# Altium project Bemine-neo.PrjPcb
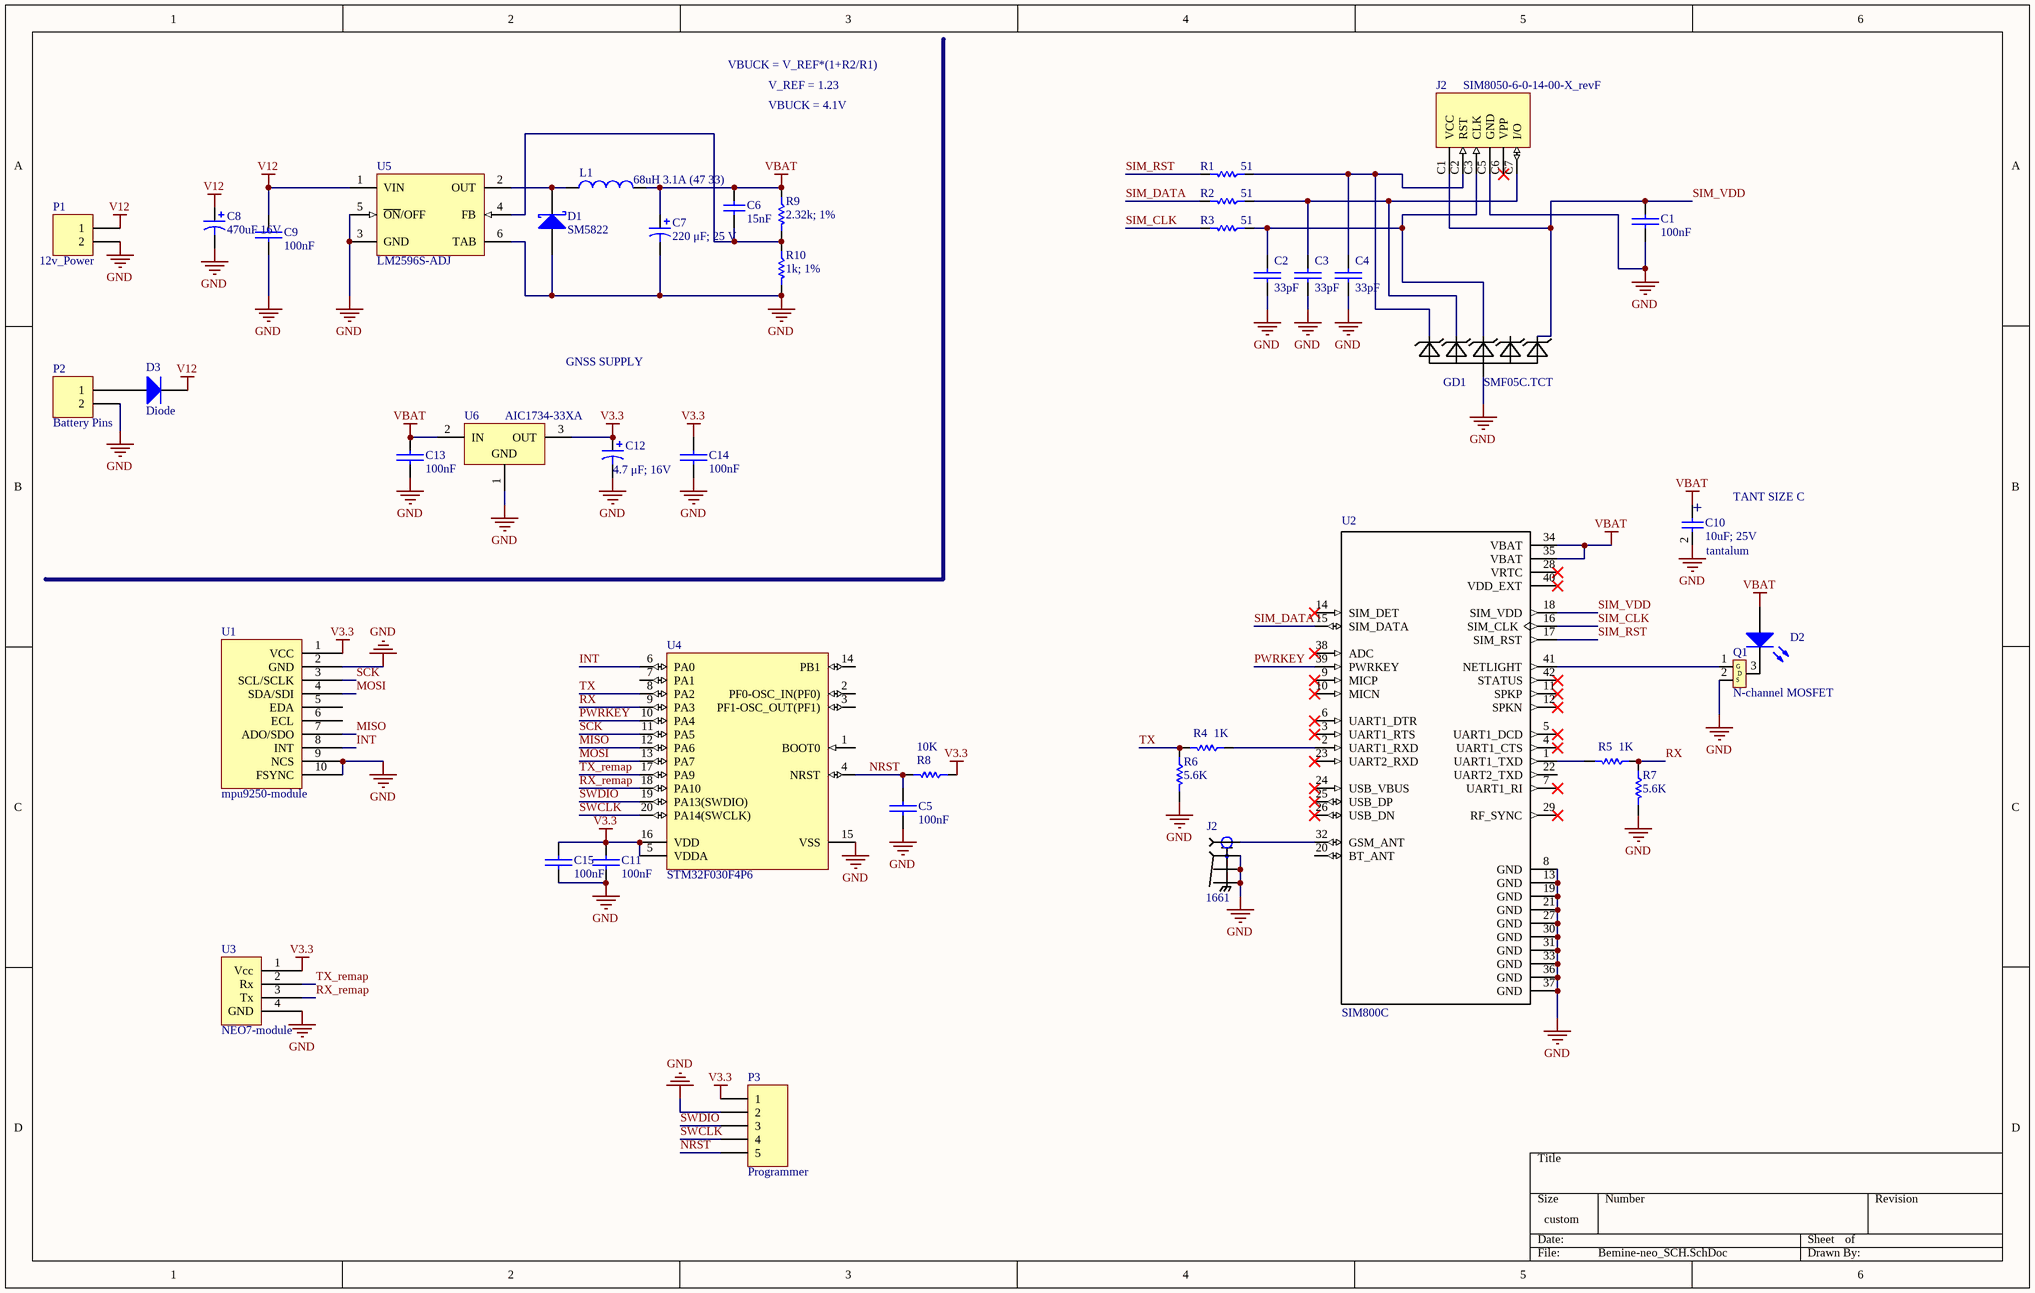
[diagram p0: Bemine-neo_SCH.SchDoc]
1 sheet, 42 parts. Net scope: global (net labels, ports and power ports of the same name join across sheets).

## Sheet Bemine-neo_SCH.SchDoc
size 381 x 241 mm

### Parts
(Parts that share a designator on the sheet are numbered #1, #2 ... from top to bottom, then left to right.)
C1  100nF  [0603R-1k]
C2  33pF  [0603R-1k]
C3  33pF  [0603R-1k]
C4  33pF  [0603R-1k]
C5  100nF  [0603R-1k]
C6  15nF  [0603R-1k]
C7  220 μF; 25 V  [E]
C8  470uF 16V  [F]
C9  100nF  [0603R-1k]
C10  10uF; 25V  TYPE: tantalum  [CAPCP6032X280N]
C11  100nF  [0603R-1k]
C12  4.7 μF; 16V  [CAPR5-4X5]
C13  100nF  [0603R-1k]
C14  100nF  [0603R-1k]
C15  100nF  [0603R-1k]
D1  SM5822  [SMB]
D2  LED2  [C1206]  (value not drawn)
D3  Diode  [SMB]
GD1  SMF05C.TCT  [SC70-6]
J2#1  SIM8050-6-0-14-00-X_revF  [SIM8050-6-0-14-00-X_revF]
J2#2  1661  [MOLEX_1661]
L1  68uH 3.1A (47 33)  [CAPR5-4X5]
P1  12v_Power  [phoenix-2pin-200mil]
P2  Battery Pins  [HDR1X2]
P3  Programmer  [HDR1X5]
Q1  N-channel MOSFET  [SOT23]
R1  51  [0603R-1k]
R2  51  [0603R-1k]
R3  51  [0603R-1k]
R4  1K  [0603R-1k]
R5  1K  [0603R-1k]
R6  5.6K  [0603R-1k]
R7  5.6K  [0603R-1k]
R8  10K  [0603R-1k]
R9  2.32k; 1%  [0603R-1k]
R10  1k; 1%  [0603R-1k]
U1  mpu9250-module  [mpu9250-module]
U2  SIM800C  [LCC110P1570X1760X250-42N]
U3  NEO7-module  [NEO7-module]
U4  STM32F030F4P6  [STM-TSSOP20_N]
U5  LM2596S-ADJ  [TS5B_N]
U6  AIC1734-33XA  [SOT89N]

### Nets
GND: C1.2(-) C2.2(-) C3.2(-) C4.2(-) C5.2(-) C7.2 C8.2 C9.2(-) C10.2 C11.2(-) C12.2 C13.2(-) C14.2(-) C15.2(-) D1.1(A) GD1.2(A) J2#1.C5(GND) J2#2.2(GND) J2#2.3(GND) J2#2.4(GND) P1.2 P2.2 P3.2 Q1.2(S) R6.2 R7.2 R10.2 U1.2(GND) U1.9(NCS) U1.10(FSYNC) U2.8(GND) U2.13(GND) U2.19(GND) U2.21(GND) U2.27(GND) U2.30(GND) U2.31(GND) U2.33(GND) U2.36(GND) U2.37(GND) U3.4(GND) U4.15(VSS) U5.3(GND) U5.5(~{ON}/OFF) U5.6(TAB) U6.1(GND)
V3.3: C11.1(+) C12.1 C14.1(+) C15.1(+) P3.1 R8.1 U1.1(VCC) U3.1(Vcc) U4.5(VDDA) U4.16(VDD) U6.3(OUT)
V12: C8.1 C9.1(+) D3.2(K) P1.1 U5.1(VIN)
VBAT: C6.2 C7.1 C10.1 C13.1(+) D2.1(A) L1.2 R9.1 U2.34(VBAT) U2.35(VBAT) U6.2(IN)
INT: U1.8(INT) U4.6(PA0)
MISO: U1.7(ADO/SDO) U4.12(PA6)
MOSI: U1.4(SDA/SDI) U4.13(PA7)
NRST: C5.1(+) P3.5 R8.2 U4.4(NRST)
PWRKEY: U2.39(PWRKEY) U4.10(PA4)
RX: R5.1 R7.1 U4.9(PA3)
RX_remap: U3.3(Tx) U4.18(PA10)
SCK: U1.3(SCL/SCLK) U4.11(PA5)
SIM_CLK: R3.2 U2.16(SIM_CLK)
SIM_DATA: R2.2 U2.15(SIM_DATA)
SIM_RST: R1.2 U2.17(SIM_RST)
SIM_VDD: C1.1(+) GD1.6(C5) J2#1.C1(VCC) U2.18(SIM_VDD)
SWCLK: P3.4 U4.20(PA14(SWCLK))
SWDIO: P3.3 U4.19(PA13(SWDIO))
TX: R4.2 R6.1 U4.8(PA2)
TX_remap: U3.2(Rx) U4.17(PA9)
NetC2_1: C2.1(+) GD1.4(C3) J2#1.C3(CLK) R3.1
NetC3_1: C3.1(+) GD1.3(C2) J2#1.C7(I/O) R2.1
NetC4_1: C4.1(+) GD1.1(C1) J2#1.C2(RST) R1.1
NetC6_1: C6.1 R9.2 R10.1 U5.4(FB)
NetD1_2: D1.2(K) L1.1 U5.2(OUT)
NetD2_2: D2.2(K) Q1.3(D)
NetD3_1: D3.1(A) P2.1
NetJ2#2_1: J2#2.1(SIG) U2.32(GSM_ANT)
NetQ1_1: Q1.1(G) U2.41(NETLIGHT)
NetR4_1: R4.1 U2.2(UART1_RXD)
NetR5_2: R5.2 U2.1(UART1_TXD)

Not connected (* = marked no-connect by the designer): GD1 5(C4); J2#1 C6(VPP)*; U1 5(EDA) 6(ECL); U2 3(UART1_RTS)* 4(UART1_CTS)* 5(UART1_DCD)* 6(UART1_DTR)* 7(UART1_RI)* 9(MICP)* 10(MICN)* 11(SPKP)* 12(SPKN)* 14(SIM_DET)* 20(BT_ANT) 22(UART2_TXD) 23(UART2_RXD)* 24(USB_VBUS)* 25(USB_DP)* 26(USB_DN)* 28(VRTC)* 29(RF_SYNC)* 38(ADC)* 40(VDD_EXT)* 42(STATUS)*; U4 1(BOOT0) 2(PF0-OSC_IN(PF0)) 3(PF1-OSC_OUT(PF1)) 7(PA1) 14(PB1)

### Notes on the sheet
- VBUCK = V_REF*(1+R2/R1)
- V_REF = 1.23
- VBUCK = 4.1V
- GNSS SUPPLY
- (near C10) TANT SIZE C
- (near C10) +

### Library data of the parts
C1-C5 C9 C11 C13-C15 = Cap-Bipolar: Bipolar Capacitor; Voltage: 100V; Designer: Saeid Jorablo; Organazation: ControTec; Adding Date: 1387/12/20
  C1 C5 C9 C11 C13-C15: Value: 100nF
  C2-C4: Value: 33pF
C6 = Cap: Capacitor; STATE: NOT-AVAILABLE; TYPE: tantalum; Published: 8-Jun-2000; LatestRevisionDate: 17-Jul-2002; LatestRevisionNote: Re-released for DXP Platform.; PackageReference: RAD-0.3; Publisher: Altium Limited; PackageDescription: Radial Cap, Thru-Hole; 2 Leads; 0.3 in Pin Spacing
C7 = 94SH107X0016EBP: Solid Aluminum Capacitor with Organic Semiconductor Electrolyte: 100uF, 16V, Bulk Pack; Note: Part Numbers shown are for ± 20% capacitance tolerance (X0).; PCB_Layout: Complies with Manufacturer's Recommendation.; DrillSize: Nominal, Rounded to the nearest 0.1mm; Published: 19-Mar-2004; DatasheetDocument: 23-May-2001; PackageReference: E; Publisher: Altium Limited; ComponentLink1Description: Manufacturer Link; ComponentLink1URL: http://www.vishay.com/; ComponentLink2Description: Datasheet; ComponentLink2URL: http://www.vishay.com/docs/90006/94sh.pdf; Value: 100uF
C8 = 94SS477X0004FBP: Solid Aluminum Capacitor with Organic Semiconductor Electrolyte: 470uF, 4V, Bulk Pack; Note: Part Numbers shown are for ± 20% capacitance tolerance (X0).; PCB_Layout: Complies with Manufacturer's Recommendation.; DrillSize: Nominal, Rounded to the nearest 0.1mm; Published: 19-Mar-2004; DatasheetDocument: 23-May-2001; PackageReference: F; Publisher: Altium Limited; ComponentLink1Description: Manufacturer Link; ComponentLink1URL: http://www.vishay.com/; ComponentLink2Description: Datasheet; ComponentLink2URL: http://www.vishay.com/docs/90008/94ss.pdf; Value: 470uF
C10 = Cap: Capacitor; STATE: NOT-AVAILABLE; Published: 8-Jun-2000; LatestRevisionDate: 17-Jul-2002; LatestRevisionNote: Re-released for DXP Platform.; PackageReference: RAD-0.3; Publisher: Altium Limited; PackageDescription: Radial Cap, Thru-Hole; 2 Leads; 0.3 in Pin Spacing
C12 = WCAP-PSLP 5x5.8x1.4 875105359003: WCAP-PSLP Aluminum Polymer Capacitors , 22 μF; + / - 20%; 16 V , 5 x 5,8; Manufacturer: Wurth Elektronik; E-mail: libraries@we-online.com; Capacitance: 22 μF; Characteristics: Aluminum Polymer Capacitors;Recommended soldering: Reflow;Operating temperature: –55 °C to +105 °C;Low profile SMD product series;Low ESR at high frequency range;High permissible ripple current;Load life: 2000 h @ +105 °C; ComponentLink1Description: Manufacturer; ComponentLink1URL: http://www.we-online.com; ComponentLink2Description: Datasheet; ComponentLink2URL: http://katalog.we-online.de/pbs/datasheet/875105359003.pdf; Created by: Karrer Zheng; Created Date: 5/13/2015; Application: Low voltage port filtering, appplid to high-end switching power supply, PC(desktop,laptop ),industrial computer, VGA card, server power, charger, TV, digital set-top box,DC-DC power module, game machine etc which consume large current with high speed circuit.; partNo: 875105359003
D1 = D Schottky: Schottky Diode; Published: 8-Jun-2000; LatestRevisionDate: 17-Jul-2002; LatestRevisionNote: Re-released for DXP Platform.; PackageReference: SMB; Publisher: Altium Limited; PackageDescription: DO-214-AA/SMB; 2 C-Bend Leads; Body 5.3 x 3.6 mm, inc. leads (LxW); Code_JEDEC: DO-214-AA
D2 = LED2: Typical RED, GREEN, YELLOW, AMBER GaAs LED; Published: 8-Jun-2000; LatestRevisionDate: 17-Jul-2002; LatestRevisionNote: Re-released for DXP Platform.; PackageVersion: Feb-2002; PackageReference: 3.2X1.6X1.1; Publisher: Altium Limited; PackageDescription: SM LED; 2 Flat Leads
D3 = Diode: Default Diode; Published: 8-Jun-2000; LatestRevisionDate: 17-Jul-2002; LatestRevisionNote: Re-released for DXP Platform.; PackageVersion: Sep-1996; PackageReference: SMC; Publisher: Altium Limited; PackageDescription: DO-214-AB/SMC; 2 C-Bend Leads; Body 7.9 x 5.9 mm, inc. leads (LxW); Code_JEDEC: DO-214-AB
GD1 = SMF05C.TCT: MF: Semtech; Price: None; Package: SOT-363 Diodes Inc.; Availability: Unavailable; MP: SMF05C.TCT; Value: *
J2#1 = SIM8050-6-0-14-00-X_revF: Nano SIM Card Connector, Push-Pull Type, 6 Pin, SMT, Profile 1.35mm
J2#2 = 1661: uFL SMT Antenna Connector; MF: Keystone Electronics; Availability: Unavailable; Package: None; SnapEDA_Link: https://www.snapeda.com/parts/1661/Keystone%20Electronics/view-part/?ref=snap; Price: None; MP: 1661; Value: *
L1 = Inductor: Code_IEC: 1005; Value: 10mH; Published: 8-Jun-2000; LatestRevisionDate: 29-May-2009; LatestRevisionNote: IPC-7351 Footprint Added.; PackageReference: 0402-A; Publisher: Altium Limited; PackageDescription: Chip Inductor; Code_JEITA: 0402
P1 P2 = Header 2: Header, 2-Pin; LatestRevisionDate: 17-Jul-2002; LatestRevisionNote: Re-released for DXP Platform.; Publisher: Altium Limited
P3 = Header 5: Header, 5-Pin; LatestRevisionDate: 17-Jul-2002; LatestRevisionNote: Re-released for DXP Platform.; Publisher: Altium Limited
Q1 = 2N7002: NPN transistor
R1-R10 = Resistor
  R1-R3: Value: 51
  R4 R5: Value: 1K
  R6 R7: Value: 5.6K
  R8: Value: 10K
  R9: Value: 2.32k; 1%
  R10: Value: 1k; 1%
U2 = SIM800C: Module: GSM/Bluetooth; GPRS; 2G; 1800MHz, 900MHz; 85.6kbps; SMD; MF: Simcom; Price: None; Availability: Unavailable; Package: None; SnapEDA_Link: https://www.snapeda.com/parts/SIM800C/Simcom/view-part/?ref=snap; MP: SIM800C; Value: *
U4 = STM32F030F4P6: ARM Cortex-M0 32-bit MCU, 16 KB Flash, 4 KB Internal RAM, 15 I/Os, 20-pin TSSOP, -40 to 85 degC, Tube; FLASH Size (Prog) (kB): 16; I/Os (High Current): 15; Internal RAM Size (kB): 4; Operating Frequency(F) (Processor speed) (MHz): 48; Supply Voltage(Vcc) min (V): 2.4; DatasheetVersion: Rev. 1; PackageVersion: Rev. 1, 11/2012; PackageReference: TSSOP20; PackageDescription: 20-Pin Thin Shrink Small Outline Package, 6.5 x 4.4 mm Body, 0.65 mm Pitch; Supplier 1: Digi-Key; Supplier Part Number 1: 497-14044-5-ND; Supplier 2: Newark; Supplier Part Number 2: 06X3648; Supplier 3: Mouser; Supplier Part Number 3: 511-STM32F030F4P6; Core: ARM Cortex-M0; Packing: Tube; Mounting Technology: Surface Mount; PartNumber: STM32F030F4P6; ComponentLink1Description: Manufacturer URL; ComponentLink1URL: http://www.st.com/web/en/home.html; ComponentLink2Description: Datasheet; ComponentLink2URL: http://www.st.com/st-web-ui/static/active/en/resource/technical/document/datasheet/DM00088500.pdf; ComponentLink3Description: Package Specification; ComponentLink3URL: http://www.st.com/st-web-ui/static/active/en/resource/technical/document/datasheet/DM00065136.pdf
U5 = LM2596S-ADJ: SIMPLE SWITCHER® Power Converter 150 KHz 3A Step-Down Voltage Regulator, 5-pin TO-263; Manufacturer: National Semiconductor; PackageTopMarking: NSUZXYTTE#*LM2596S*-ADJ P+; PowerWise: N; Published: 4-Dec-2008; DatasheetVersion: May-2002; PackageVersion: revD, Apr-2005; PackageReference: TS5B; Publisher: Altium Limited; PackageDescription: TO-263, Molded, .400 x .390 x .180in, 5 Lead, .067in Pitch, Surface Mount; Supplier 1: Farnell; Supplier Part Number 1: 1523864; Supplier 2: Farnell; Supplier Part Number 2: 9494367; PartNumber: LM2596S-ADJ; RoHS: N; PinCount: 5; CompType: Switcher; Code_JEDEC: MO-169-AB; ComponentLink1Description: LM2596 Datasheet; ComponentLink1URL: http://www.national.com/ds/LM/LM2596.pdf; ComponentLink2Description: LM2596 Web Page; ComponentLink2URL: http://www.national.com/pf/LM/LM2596.html; ComponentLink3Description: TS5B Package Page; ComponentLink3URL: http://www.national.com/packaging/folders/ts5b.html
U6 = HT7530-1: 3.0V 100mA Low Power,  Low Dropout Voltage (LDO) Regulator; Published: 30-Mar-2007; DatasheetVersion: rev1.50, Jan-2006; PackageVersion: Jan-2006; PackageReference: SOT-89; Publisher: Altium Limited; PackageDescription: 3-Pin SOT-89 Package 1.5 mm Pitch, 4.1 mm Lead Span; Code_IPC: SOT89; ComponentLink1Description: Manufacturer Link; ComponentLink1URL: http://www.holtek.com/; ComponentLink2Description: Datasheet; ComponentLink2URL: http://www.holtek.com/pdf/consumer/75xx_1v150.pdf